# Altium project NANO33BLE_V2.0.PrjPcb
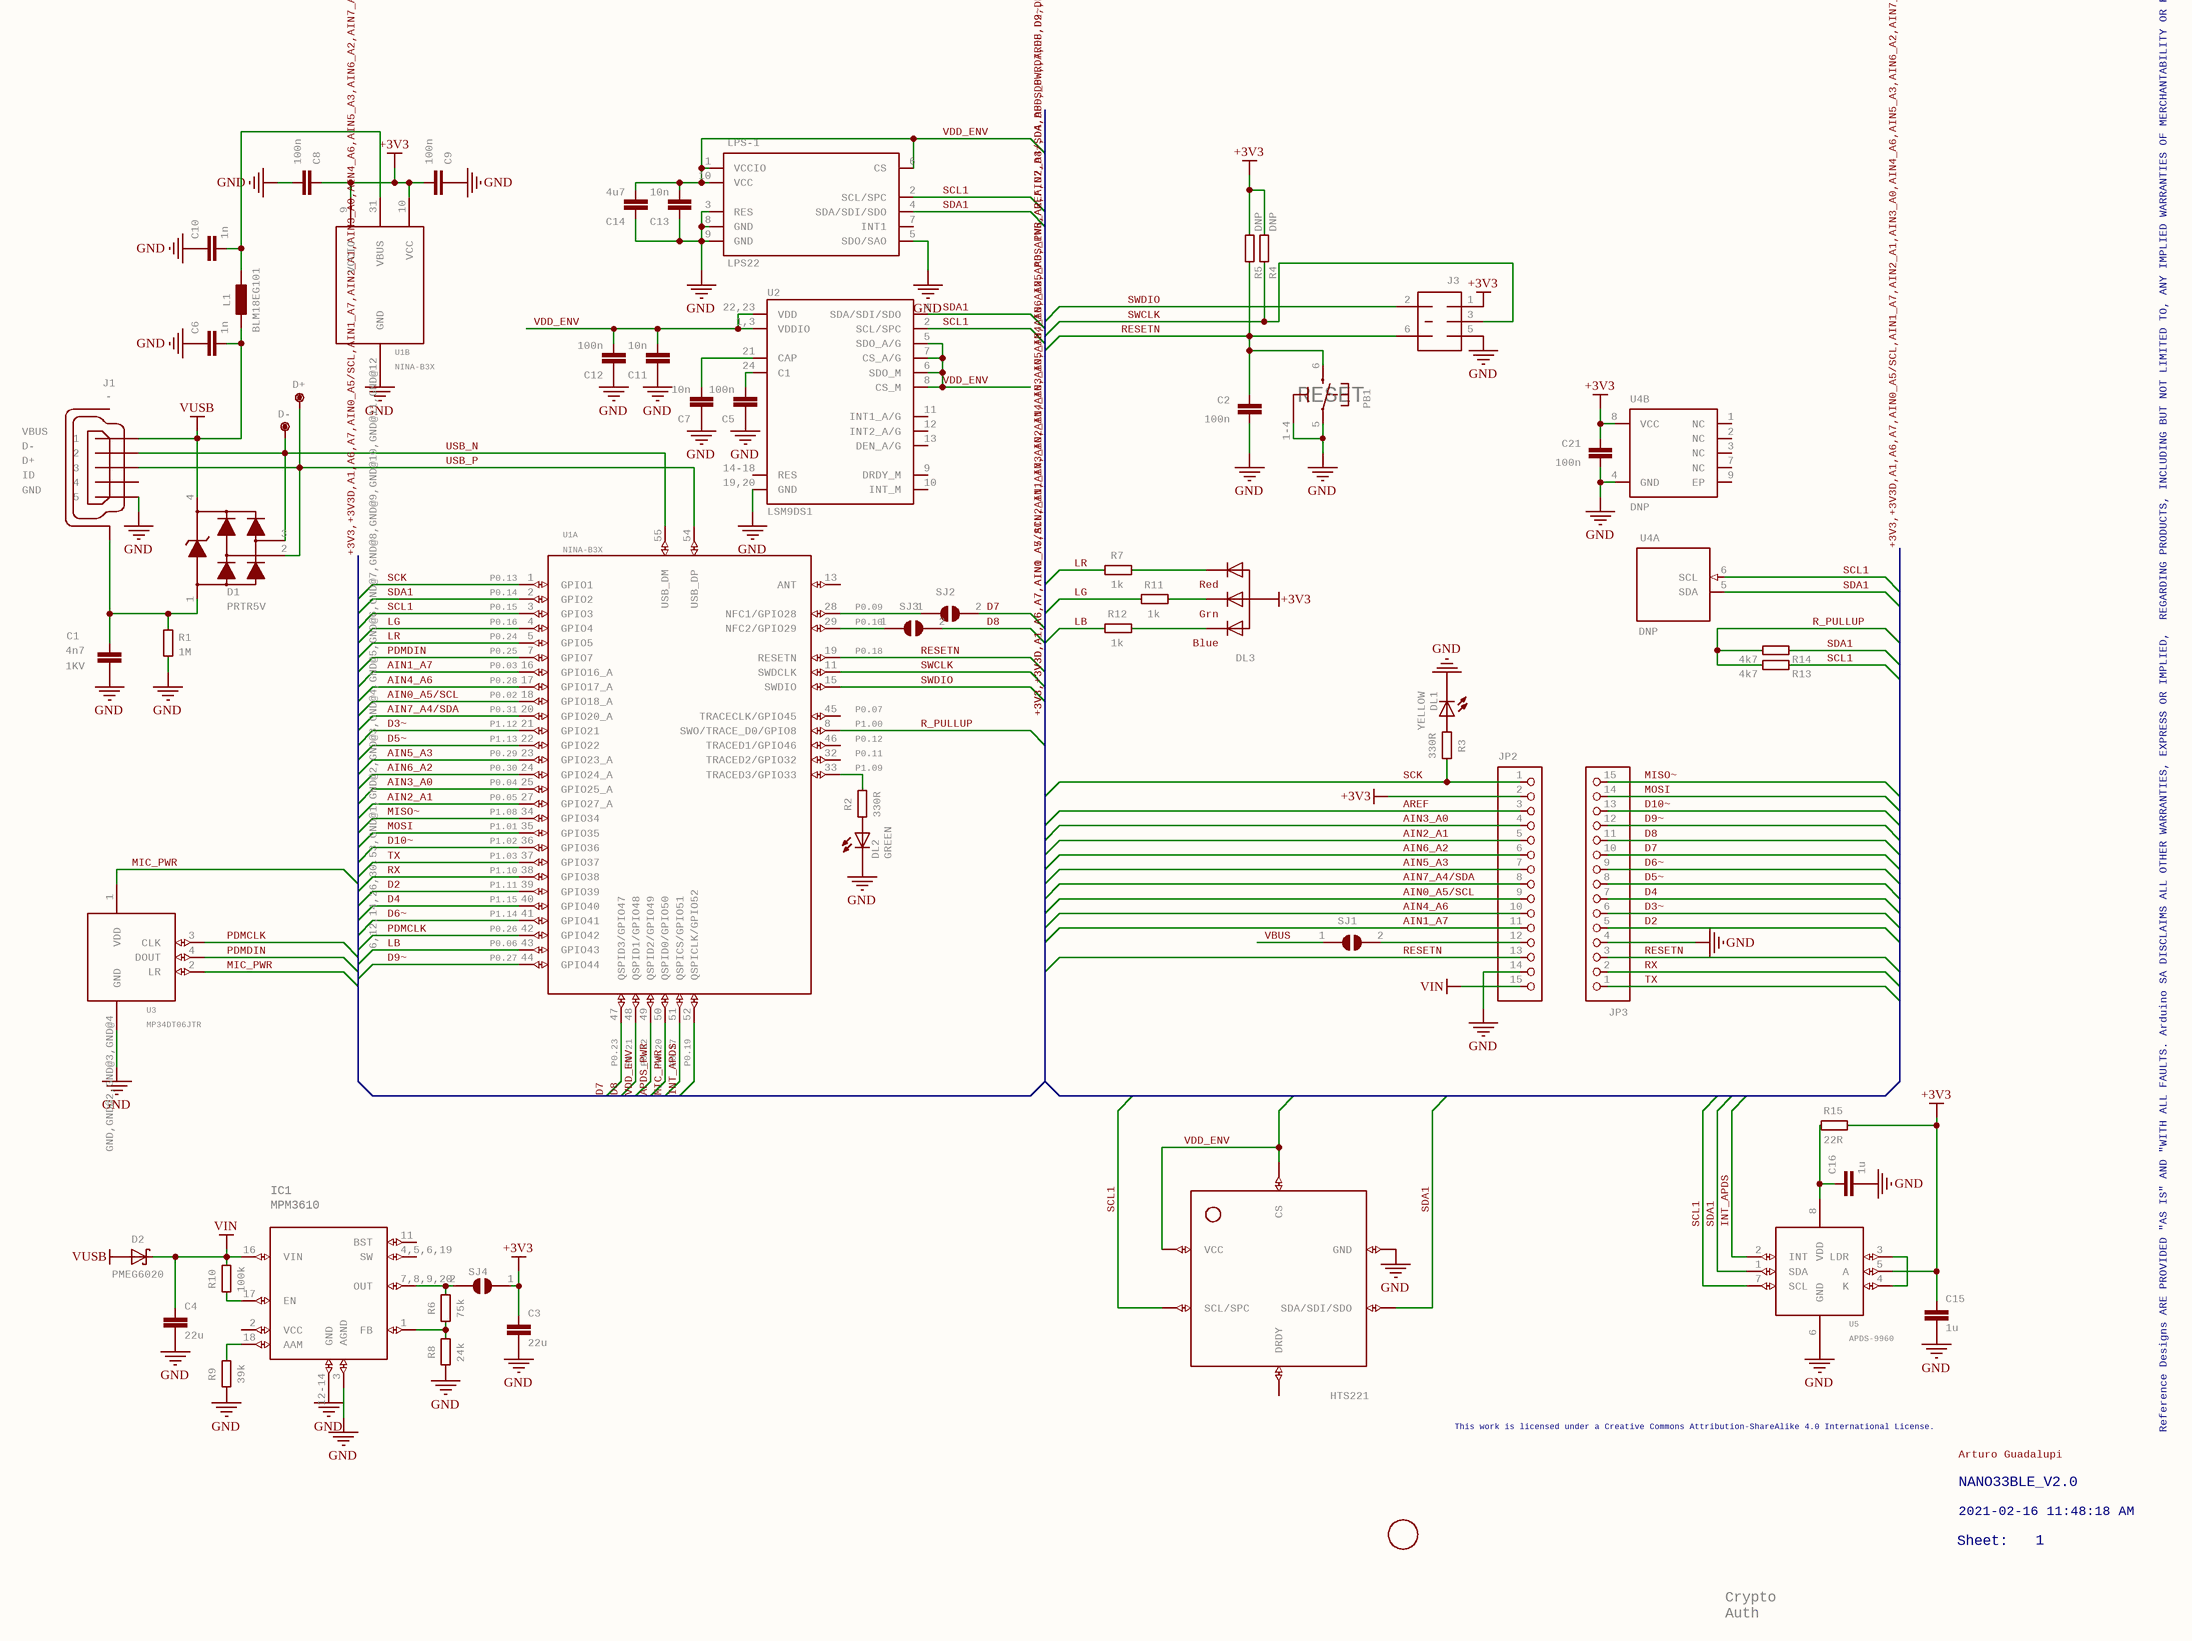
[diagram p0: NANO33BLE_V2.0.SchDoc]
1 sheet, 58 parts. Net scope: global (net labels, ports and power ports of the same name join across sheets).
Board file: NANO33BLE_V2.0.PcbDoc

## Sheet NANO33BLE_V2.0.SchDoc: NANO33BLE_V2.0
size 409 x 289 mm; Origin: Eagle; Date: 2021-02-16 11:48:18 AM; SheetNumber: 1; CODE-ARDUINO: DNP; DATASHEET: DNP; DISTRIBUTOR-LINK: DNP; DISTRIBUTOR-PN: DNP; MANUFACTURER: DNP; MANUFACTURER-PN: DNP; NOTE: DNP; Value: DNP; GateName_1: G$1; SymbolName_1: A3L-LOC; LibraryName: Arduino-utility; DeviceSetName: A3-FRAME; Sheet: Sheet:; ReferenceDesignsAREPROVIDED"ASIS"AND"WITHALLFAULTS.ArduinoSADISCLAIMSALLOTHERWARRANTIES,EXPRESSORIMPLIED,
REGARDINGPRODUCTS,INCLUDINGBUTNOTLIMITEDTO,ANYIMPLIEDWARRANTIESOFMERCHANTABILITYORFITNESSFORAPARTICULARPURPOSE

ArduinoSAmaymakechangestospecificationsandproductdescriptionsatanytime,withoutnotice.TheCustomermustnot
relyontheabsenceorcharacteristicsofanyfeaturesorinstructionsmarked"reserved"or"undefined."ArduinoSAreserves
theseforfuturedefinitionandshallhavenoresponsibilitywhatsoeverforconflictsorincompatibilitiesarisingfromfuturechangestothem.
TheproductinformationontheWebSiteorMaterialsissubjecttochangewithoutnotice.Donotfinalizeadesignwiththisinfo

ARDUINOandotherArduinobrandsandlogosandTrademarksofArduinoSA.AllArduinoSATrademarkscannotbeusedwithoutowner'sformalpermission: Reference Designs ARE PROVIDED "AS IS" AND "WITH ALL FAULTS. Arduino SA DISCLAIMS ALL OTHER WARRANTIES, EXPRESS OR IMPLIED, / REGARDING PRODUCTS, INCLUDING BUT NOT LIMITED TO, ANY IMPLIED WARRANTIES OF MERCHANTABILITY OR FITNESS FOR A PARTICULAR PURPOSE / Arduino SA may make changes to specifications and product descriptions at any time, without notice. The Customer must not / rely on the absence or characteristics of any features or instructions marked "reserved" or "undefined." Arduino SA reserves / these for future definition and shall have no responsibility whatsoever for conflicts or incompatibilities arising from future changes to them. / The product information on the Web Site or Materials is subject to change without notice. Do not finalize a design with this info / ARDUINO and other Arduino brands and logos and Trademarks of Arduino SA. All Arduino SA Trademarks cannot be used without owner's formal permission; ThisworkislicensedunderaCreativeCommonsAttribution-ShareAlike4.0InternationalLicense.: This work is licensed under a Creative Commons Attribution-ShareAlike 4.0 International License.

### Parts
C1  4n7  VOLTAGE: 1KV  [0805-R2013X50N]
C2  100n  [0402-1005X55N]
C3  22u  [0805-R2013X50N]
C4  22u  [0805-R2013X50N]
C5  100n  [0402-1005X55N]
C6  1n  [0402-1005X55N]
C7  10n  [0402-1005X55N]
C8  100n  [0402-1005X55N]
C9  100n  [0402-1005X55N]
C10  1n  [0402-1005X55N]
C11  10n  [0402-1005X55N]
C12  100n  [0402-1005X55N]
C13  10n  [0402-1005X55N]
C14  4u7  [0402-1005X55N]
C15  1u  [0402-1005X55N]
C16  1u  [0402-1005X55N]
C21  100n  [0402-1005X55N]
D1  PRTR5V  [SOT190P230X110-4N]
D2  PMEG6020  [SODFL3517X110N]
D+  DNP  [TP-1.00MM]  (value not drawn)
D-  DNP  [TP-1.00MM]  (value not drawn)
DL1  YELLOW  [LEDC1608X80N-AK]
DL2  GREEN  [LEDC1608X80N-AK]
DL3  -  [SMLP34RGB2W]  (value not drawn)
FD1  DNP  [FD-1-1.5]  (value not drawn)
HS-1  HTS221  [HTS221]  (value not drawn)
IC1  MPM3610  [MPM3610]
J1  -  [ZX62-AB-5PA]
J3  DNP  [2X03-TP1]  (value not drawn)
JP2  PINHD-1X15-CASTELLATED  [1X15-CASTELL]  (value not drawn)
JP3  PINHD-1X15-CASTELLATED  [1X15-CASTELL]  (value not drawn)
L1  BLM18EG101  [0603-1608X90N]
LPS-1  LPS22  [LPS22H]
PB1  PTS820  [C&K_PTS820_NO_HOLES]  (value not drawn)
R1  1M  [0402-1005X55N]
R2  330R  [0402-1005X55N]
R3  330R  [0402-1005X55N]
R4  DNP  [0402-1005X55N]
R5  DNP  [0402-1005X55N]
R6  75k  [0402-1005X55N]
R7  1k  [0402-1005X55N]
R8  24k  [0402-1005X55N]
R9  39k  [0402-1005X55N]
R10  100k  [0402-1005X55N]
R11  1k  [0402-1005X55N]
R12  1k  [0402-1005X55N]
R13  4k7  [0402-1005X55N]
R14  4k7  [0402-1005X55N]
R15  22R  [0402-1005X55N]
SJ1  DNP  [SJ]  (value not drawn)
SJ2  DNP  [SJ]  (value not drawn)
SJ3  DNP  [SJ]  (value not drawn)
SJ4  DNP  [SJ]  (value not drawn)
U1  NINA-B3X  [NINA-B3X]  (parts A,B of 2)
U2  LSM9DS1  [LSM9DS1_TEMP_LGA24-8X4]
U3  MP34DT06JTR  [HCLGA]
U4  DNP  [SON50P300X200X60-9N-EP160X140]  (parts A,B of 2)
U5  APDS-9960  [APDS9960]

### Nets
+3V3: C3.1 C8.1 C9.2 C15.1 C21.1 DL3.1(A) J3.1 JP2.2 R4.2 R5.2 R15.2 SJ4.1 U1.9(VCCIO) U1.10(VCC) U4.8(VCC) U5.5(A)
GND: C1.2 C2.2 C3.2 C4.2 C5.1 C6.1 C7.1 C8.2 C9.1 C10.1 C11.1 C12.1 C13.1 C14.1 C15.2 C16.2 C21.2 DL1.C DL2.C HS-1.P$5.GND(GND) IC1.3(AGND) IC1.12-14(GND) J1.5 J3.5 JP2.14 JP3.4 LPS-1.3(RES) LPS-1.5(SDO/SAO) LPS-1.8(GND) LPS-1.9(GND) PB1.1-4 PB1.5 R1.1 R8.1 R9.1 U1.6,12,14,26,30,53,GND@1,GND@2,GND@3,GND@4,GND@5,GND@6,GND@7,GND@8,GND@9,GND@10,GND@11,GND@12(GND) U2.19,20(GND) U3.GND,GND@2,GND@3,GND@4(GND) U4.4(GND) U5.6(GND)
VIN: C4.1 D2.C IC1.16(VIN) JP2.15 R10.2
VUSB: C6.2 D1.4 D2.A J1.1 L1.1
AIN0_A5/SCL: JP2.9 U1.18(GPIO18_A)
AIN1_A7: JP2.11 U1.16(GPIO16_A)
AIN2_A1: JP2.5 U1.27(GPIO27_A)
AIN3_A0: JP2.4 U1.25(GPIO25_A)
AIN4_A6: JP2.10 U1.17(GPIO17_A)
AIN5_A3: JP2.7 U1.23(GPIO23_A)
AIN6_A2: JP2.6 U1.24(GPIO24_A)
AIN7_A4/SDA: JP2.8 U1.20(GPIO20_A)
APDS_PWR: U1.50(QSPID0/GPIO50)
AREF: JP2.3
D2: JP3.5 U1.39(GPIO39)
D3~: JP3.6 U1.21(GPIO21)
D4: JP3.7 U1.40(GPIO40)
D5~: JP3.8 U1.22(GPIO22)
D6~: JP3.9 U1.41(GPIO41)
D7: JP3.10 SJ2.2 U1.47(QSPID3/GPIO47)
D8: JP3.11 R12.1 SJ3.2 U1.43(GPIO43) U1.48(QSPID1/GPIO48)  [also labelled LB]
D9~: JP3.12 U1.44(GPIO44)
D10~: JP3.13 U1.36(GPIO36)
INT_APDS: U1.52(QSPICLK/GPIO52) U5.2(INT)
LG: R11.1 U1.4(GPIO4)
LR: R7.1 U1.5(GPIO5)
MIC_PWR: U1.51(QSPICS/GPIO51) U3.1(VDD) U3.2(LR)
MISO~: JP3.15 U1.34(GPIO34)
MOSI: JP3.14 U1.35(GPIO35)
PDMCLK: U1.42(GPIO42) U3.3(CLK)
PDMDIN: U1.7(GPIO7) U3.4(DOUT)
R_PULLUP: R13.2 R14.2 U1.8(SWO/TRACE_D0/GPIO8)
RESETN: C2.1 J3.6 JP2.13 JP3.3 PB1.6 R5.1 U1.19(RESETN)
RX: JP3.2 U1.38(GPIO38)
SCK: JP2.1 R3.2 U1.1(GPIO1)
SCL1: HS-1.P$2.SCL/SPC(SCL/SPC) LPS-1.2(SCL/SPC) R13.1 U1.3(GPIO3) U2.2(SCL/SPC) U4.6(SCL) U5.7(SCL)
SDA1: HS-1.P$4.SDA/SDI/SDO(SDA/SDI/SDO) LPS-1.4(SDA/SDI/SDO) R14.1 U1.2(GPIO2) U2.4(SDA/SDI/SDO) U4.5(SDA) U5.1(SDA)
SWCLK: J3.3 R4.1 U1.11(SWDCLK)
SWDIO: J3.2 U1.15(SWDIO)
TX: JP3.1 U1.37(GPIO37)
USB_N: D1.3 D-.X(P$1) J1.2 U1.55(USB_DM)
USB_P: D1.2 D+.X(P$1) J1.3 U1.54(USB_DP)
VBUS: SJ1.1
VDD_ENV: C11.2 C12.2 C13.2 C14.2 HS-1.P$1.VDD(VCC) HS-1.P$6.CS(CS) LPS-1.1(VCCIO) LPS-1.6(CS) LPS-1.10(VCC) U1.49(QSPID2/GPIO49) U2.1,3(VDDIO) U2.5(SDO_A/G) U2.6(SDO_M) U2.7(CS_A/G) U2.8(CS_M) U2.22,23(VDD)
NetC1_1: C1.1 D1.1 J1.6-11(SH) R1.2
NetC5_2: C5.2 U2.24(C1)
NetC7_2: C7.2 U2.21(CAP)
NetC10_2: C10.2 L1.2 U1.31(VBUS)
NetC16_1: C16.1 R15.1 U5.8(VDD)
NetDL1_A: DL1.A R3.1
NetDL2_A: DL2.A R2.1
NetDL3_2: DL3.2(RED_C) R7.2
NetDL3_3: DL3.3(BLUE_C) R12.2
NetDL3_4: DL3.4(GREEN_C) R11.2
NetIC1_1: IC1.1(FB) R6.1 R8.2
NetIC1_7,8,9,20: IC1.7,8,9,20(OUT) R6.2 SJ4.2
NetIC1_17: IC1.17(EN) R10.1
NetIC1_18: IC1.18(AAM) R9.2
NetJP2_12: JP2.12 SJ1.2
NetR2_2: R2.2 U1.33(TRACED3/GPIO33)
NetSJ2_1: SJ2.1 U1.28(NFC1/GPIO28)
NetSJ3_1: SJ3.1 U1.29(NFC2/GPIO29)
NetU5_3: U5.3(LDR) U5.4(K)

Not connected (* = marked no-connect by the designer): HS-1 P$3.DRDY(DRDY); IC1 2(VCC) 4,5,6,19(SW) 11(BST); J1 4; LPS-1 7(INT1); U1 13(ANT) 32(TRACED2/GPIO32) 45(TRACECLK/GPIO45) 46(TRACED1/GPIO46); U2 9(DRDY_M) 10(INT_M) 11(INT1_A/G) 12(INT2_A/G) 13(DEN_A/G) 14-18(RES); U4 1(NC) 2(NC) 3(NC) 7(NC) 9(EP)

### Buses and harness runs
bus +3V3,+3V3D,A1,A6,A7,AIN0_A5/SCL,AIN1_A7,AIN2_A1,AIN3_A0,AIN4_A6,AIN5_A3,AIN6_A2,AIN7_A4/SDA,APDS_PWR,AREF,D2,D3~,D4,D5~,D6~,D7,D8,D9~,D10~,GND,INT_APDS,LB,LED_BLUE,LED_GREEN,LED_RED,LG,LR,MIC_PWR,MISO~,MOSI,NFC1,NFC2,PA12_S2_TX/MOSI,PA13_S2_RX/MISO,PA14_S2_RTS/CS,PA15_S2_CTS/SCK,PA22_TC4-W0,PA23_TC4-W1,PA27_GPIO0,PA28_ACK,PB08_RST,PB11_TCC0-W5,PDMCLK,PDMDIN,RESET#,RESETN,R_PULLUP,RSTN_NINA,RX,RX_NINA,SCK,SCL1,SDA1,SWCLK,SWDIO,TX,TX_NINA,USB_N,USB_P,VBUS,VDD_ENV,VIN,VUSB = +3V3,+3V3D,A1,A6,A7,AIN1_A7,AIN2_A1,AIN3_A0,AIN4_A6,AIN5_A3,AIN6_A2,APDS_PWR,AREF,D2,D3~,D4,D5~,D6~,D7,D8,D9~,D10~,GND,LB,LED_BLUE,LED_GREEN,LED_RED,LG,LR,MISO~,MOSI,N$1,N$2,N$3,N$4,N$5,N$6,N$7,N$8,N$10,N$11,N$12,N$13,NFC1,NFC2,PA12_S2_TX/MOSI,PA13_S2_RX/MISO,PA14_S2_RTS/CS,PA15_S2_CTS/SCK,PA27_GPIO0,PA28_ACK,PB08_RST,RESETN,R_PULLUP,RSTN_NINA,RX,RX_NINA,SCK,SCL1,SDA1,SWCLK,SWDIO,TX,TX_NINA,USB_N,USB_P,VBUS,VDD_ENV,VIN,VUSB

### Notes on the sheet
- RESET
- (near HS-1) HTS221
- This work is licensed under a Creative Commons Attribution-ShareAlike 4.0 International License.
- Reference Designs ARE PROVIDED "AS IS" AND "WITH ALL FAULTS. Arduino SA DISCLAIMS ALL OTHER WARRANTIES, EXPRESS OR IMPLIED,
  REGARDING PRODUCTS, INCLUDING BUT NOT LIMITED TO, ANY IMPLIED WARRANTIES OF MERCHANTABILITY OR FITNESS FOR A PARTICULAR PURPOSE
  Arduino SA may make changes to specifications and product descriptions at any time, without notice. The Customer must not
  rely on the absence or characteristics of any features or instructions marked "reserved" or "undefined." Arduino SA reserves
  these for future definition and shall have no responsibility whatsoever for conflicts or incompatibilities arising from future changes to them.
  The product information on the Web Site or Materials is subject to change without notice. Do not finalize a design with this info
  ARDUINO and other Arduino brands and logos and Trademarks of Arduino SA. All Arduino SA Trademarks cannot be used without owner's formal permission
- Arturo Guadalupi
- NANO33BLE_V2.0
- Sheet:
- 2021-02-16 11:48:18 AM
- 1
- Crypto
  Auth

### Library data of the parts
C1 = C-0805: SMD Capacitor; MANUFACTURER: Kemet; MANUFACTURER-PN: C0805C472KDRACTU; GateName_1: G$1; SymbolName_1: C; DeviceName: -0805; CODE-ARDUINO: 0689; LibraryName: Arduino-rcl; DeviceSetName: C; DATASHEET: http://www.kemet.com/Lists/ProductCatalog/Attachments/40/KEM_C1010_X7R_HV_SMD.pdf; DISTRIBUTOR-LINK: www.kemet.com/docfinder?Partnumber=C0805C472KDRACTU; DISTRIBUTOR-PN: 399-6738-1-ND; NOTE: -
C2 C5 C8 C9 C12 C21 = C-0402: SMD Capacitor; MANUFACTURER: TDK; MANUFACTURER-PN: C1005X5R1H104K050BB; GateName_1: G$1; SymbolName_1: C; DeviceName: -0402; CODE-ARDUINO: 0132; LibraryName: Arduino-rcl; DeviceSetName: C; DATASHEET: http://www.tdk.com/pdf/TDKMLCCCapRange.pdf; DISTRIBUTOR-LINK: http://www.digikey.com/product-detail/en/tdk-corporation/C1005X5R1H104K050BB/445-5942-1-ND/2443982; DISTRIBUTOR-PN: 445-5942-1-ND; NOTE: -
C3 C4 = C-0805: SMD Capacitor; MANUFACTURER: Samsung; MANUFACTURER-PN: CL21A226MQCLQNC; GateName_1: G$1; SymbolName_1: C; DeviceName: -0805; CODE-ARDUINO: 2233; LibraryName: Arduino-rcl; DeviceSetName: C; DATASHEET: https://media.digikey.com/pdf/Data%20Sheets/Samsung%20PDFs/CL21A226MQCLQNC_character.pdf; DISTRIBUTOR-LINK: https://www.digikey.com/product-detail/en/samsung-electro-mechanics-america-inc/CL21A226MQCLQNC/1276-2412-1-ND/3890498; DISTRIBUTOR-PN: 1276-2412-1-ND; NOTE: -
C6 C10 = C-0402: SMD Capacitor; MANUFACTURER: Samsung; MANUFACTURER-PN: CL05B102KB5NNNC; GateName_1: G$1; SymbolName_1: C; DeviceName: -0402; CODE-ARDUINO: 2321; LibraryName: Arduino-rcl; DeviceSetName: C; DATASHEET: http://www.samsungsem.com/kr/support/product-search/mlcc/__icsFiles/afieldfile/2016/08/18/S_CL05B102KB5NNNC.pdf; DISTRIBUTOR-LINK: http://www.digikey.com/product-detail/en/samsung-electro-mechanics-america-inc/CL05B102KB5NNNC/1276-1032-1-ND/3889118; DISTRIBUTOR-PN: 1276-1032-1-ND; NOTE: -
C7 C11 C13 = C-0402: SMD Capacitor; MANUFACTURER: Murata; MANUFACTURER-PN: GRM155R71H103KA88J; GateName_1: G$1; SymbolName_1: C; DeviceName: -0402; CODE-ARDUINO: 0165; LibraryName: Arduino-rcl; DeviceSetName: C; DATASHEET: http://search.murata.co.jp/Ceramy/image/img/A01X/partnumbering_e_01.pdf; DISTRIBUTOR-LINK: http://www.digikey.com/product-detail/en/murata-electronics-north-america/GRM155R71H103KA88J/490-6351-1-ND/3845548; DISTRIBUTOR-PN: 490-6351-1-ND; NOTE: -
C14 = C-0402: SMD Capacitor; MANUFACTURER: Murata; MANUFACTURER-PN: GRM155R60J475ME47D; GateName_1: G$1; SymbolName_1: C; DeviceName: -0402; CODE-ARDUINO: 0833; LibraryName: Arduino-rcl; DeviceSetName: C; DATASHEET: http://search.murata.co.jp/Ceramy/image/img/A01X/partnumbering_e_01.pdf; DISTRIBUTOR-LINK: http://www.digikey.com/product-detail/en/murata-electronics-north-america/GRM155R60J475ME47D/490-5915-1-ND/3719860; DISTRIBUTOR-PN: 490-5915-1-ND; NOTE: -
C15 C16 = C-0402: SMD Capacitor; MANUFACTURER: Murata; MANUFACTURER-PN: GRM155R61E105KA12D; GateName_1: G$1; SymbolName_1: C; DeviceName: -0402; CODE-ARDUINO: 0133; LibraryName: Arduino-rcl; DeviceSetName: C; DATASHEET: http://search.murata.co.jp/Ceramy/image/img/A01X/partnumbering_e_01.pdf; DISTRIBUTOR-LINK: http://www.digikey.com/product-detail/en/murata-electronics-north-america/GRM155R61E105KA12D/490-10017-1-ND/5026367; DISTRIBUTOR-PN: 490-10017-1-ND; NOTE: -
D1 = PRTR5V0U2X,215: USB ESD protection; MANUFACTURER: NXP; GateName_1: G$1; CODE-ARDUINO: 2209; SymbolName_1: PRTR5V0U2X; LibraryName: Arduino-diodes; DeviceSetName: PRTR5V0U2X,215; DATASHEET: http://www.nxp.com/documents/data_sheet/PRTR5V0U2X.pdf; DISTRIBUTOR-LINK: http://www.digikey.com/product-detail/en/nxp-semiconductors/PRTR5V0U2X,215/568-4140-1-ND/1589981; DISTRIBUTOR-PN: 568-4140-1-ND; MANUFACTURER-PN: PRTR5V0U2X,215
D2 = PMEG6020AELRX: 60 V, 2 A low leakage current Schottky barrier rectifier   Datasheet; MANUFACTURER: NXP; GateName_1: G$1; SymbolName_1: SCHOTTKY-2; CODE-ARDUINO: 2208 or 0025; LibraryName: Arduino-diodes; DeviceSetName: PMEG6020AELRX; DATASHEET: http://www.nxp.com/documents/data_sheet/PMEG6020AELR.pdf; DISTRIBUTOR-LINK: http://www.digikey.com/products/en?keywords=%20568-12710-1-ND; DISTRIBUTOR-PN: 568-12710-1-ND; MANUFACTURER-PN: PMEG6020AELRX
D+ D- = TPTP-1.00MM: Testpoint; GateName_1: G$1; DeviceSetName: TP; SymbolName_1: TESTPOINT; DeviceName: TP-1.00MM; LibraryName: Arduino-utility; CODE-ARDUINO: DNP; DATASHEET: DNP; DISTRIBUTOR-LINK: DNP; DISTRIBUTOR-PN: DNP; MANUFACTURER: DNP; MANUFACTURER-PN: DNP
DL1 = LED-0603: LED; MANUFACTURER: Avago; MANUFACTURER-PN: HSMY-C190; GateName_1: G$1; DeviceName: -0603; CODE-ARDUINO: 2243; SymbolName_1: LED; LibraryName: Arduino-diodes; DeviceSetName: LED; DATASHEET: http://media.digikey.com/pdf/Data%20Sheets/Avago%20PDFs/HSMz-Czzz.pdf; DISTRIBUTOR-LINK: http://www.digikey.com/product-detail/en/broadcom-limited/HSMY-C190/516-1424-1-ND/637748; DISTRIBUTOR-PN: 516-1424-1-ND
DL2 = LED-0603: LED; MANUFACTURER: Avago; MANUFACTURER-PN: HSMG-C190; GateName_1: G$1; DeviceName: -0603; CODE-ARDUINO: 2204; SymbolName_1: LED; LibraryName: Arduino-diodes; DeviceSetName: LED; DATASHEET: http://media.digikey.com/pdf/Data%20Sheets/Avago%20PDFs/HSMz-Czzz.pdf; DISTRIBUTOR-LINK: http://www.digikey.com/product-detail/en/broadcom-limited/HSMG-C190/516-1425-1-ND/637749; DISTRIBUTOR-PN: 516-1425-1-ND
DL3 = RGBLED-KA: 5050 RGB LED; MANUFACTURER-PN: SMLP34RGB2W3; GateName_1: G$1; SymbolName_1: RGBLED-KA; LibraryName: Arduino-diodes; DeviceSetName: RGBLED-KA; Red: Red; Grn: Grn; Blue: Blue; CODE-ARDUINO: CODE-ARDUINO; DATASHEET: https://www.rohm.com/datasheet/SMLP34RGB2W; DISTRIBUTOR-LINK: https://www.digikey.com/product-detail/en/rohm-semiconductor/SMLP34RGB2W3/SMLP34RGB2W3CT-ND/2921110; DISTRIBUTOR-PN: SMLP34RGB2W3CT-ND
FD1 = FIDUCIAL-1.5MM: Fiducial mount; GateName_1: G$1; SymbolName_1: ARDUINO_FIDUCIAL; DeviceName: -1.5MM; LibraryName: Arduino-utility; DeviceSetName: FIDUCIAL; CODE-ARDUINO: DNP; DATASHEET: DNP; DISTRIBUTOR-LINK: DNP; DISTRIBUTOR-PN: DNP; MANUFACTURER: DNP; MANUFACTURER-PN: DNP
HS-1 = HTS221: MANUFACTURER: STMicroelectronics; MANUFACTURER-PN: HTS221TR; GateName_1: G$1; CODE-ARDUINO: A5356; SymbolName_1: HTS221; LibraryName: Arduino-Sensors; DeviceSetName: HTS221; DATASHEET: https://nl.mouser.com/datasheet/2/389/hts221-954783.pdf; DISTRIBUTOR-LINK: https://nl.mouser.com/ProductDetail/STMicroelectronics/HTS221TR?qs=%2fha2pyFaduhYqhgVSCoMJjbIcKdCD1D5p03chi4OA3k%3d; DISTRIBUTOR-PN: 511-HTS221TR
IC1 = MPM3610: MPM3610 Step Down Regulator; MANUFACTURER: MPS; MANUFACTURER-PN: MPM3610AGQV-P; GateName_1: G$1; CODE-ARDUINO: 2093; RESTRICTIONS: NO; SymbolName_1: MPM3610; LibraryName: Arduino-ICs; DeviceSetName: MPM3610; DATASHEET: https://www.monolithicpower.com/pub/media/document/MPM3610_r1.01.pdf; DISTRIBUTOR-LINK: https://www.digikey.com/product-detail/en/monolithic-power-systems-inc/MPM3610AGQV-P/1589-1249-1-ND/5298336; DISTRIBUTOR-PN: 1589-1249-1-ND
J1 = USB-MICRO: USB - micro AB USB 2.0 Receptacle Connector 5 Position Surface Mount, Right Angle, Horizontal; MANUFACTURER: Hirose; MANUFACTURER-PN: ZX62-AB-5PA(31); GateName_1: G$1; CODE-ARDUINO: 2219; SymbolName_1: USB-MICRO; LibraryName: Arduino-connectors; DeviceSetName: USB-MICRO; VBUS: VBUS; D-: D-; D+: D+; ID: ID; GND: GND; DATASHEET: https://www.hirose.com/product/en/download_file/key_name/ZX/category/Catalog/doc_file_id/31704/?file_category_id=4&item_id=13&is_series=1; DISTRIBUTOR-LINK: http://www.digikey.com/product-detail/en/hirose-electric-co-ltd/ZX62-AB-5PA(31)/H125279CT-ND/5994741; DISTRIBUTOR-PN: H125279CT-ND
J3 = PINHD-2X03(NO4): PIN HEADER; GateName_1: G$1; SymbolName_1: 3X02(NO4); LibraryName: Arduino-connectors; DeviceSetName: PINHD-2X03(NO4); CODE-ARDUINO: DNP; DATASHEET: DNP; DISTRIBUTOR-LINK: DNP; DISTRIBUTOR-PN: DNP; MANUFACTURER: DNP; MANUFACTURER-PN: DNP
JP2 JP3 = PINHD-1X15-CASTELLATED: PIN HEADER; GateName_1: A; SymbolName_1: PINHD15; DeviceName: -CASTELLATED; LibraryName: Arduino-connectors; DeviceSetName: PINHD-1X15
L1 = FERRITE0603: SMD ferrite; MANUFACTURER: Murata; MANUFACTURER-PN: BLM18EG101TN1D; GateName_1: >NAME; DeviceName: 0603; SymbolName_1: FERRITE; LibraryName: Arduino-rcl; DeviceSetName: FERRITE; CODE-ARDUINO: -; DATASHEET: http://www.murata.com/en-us/products/productdata/8796747366430/ENFA0021.pdf; DISTRIBUTOR-LINK: https://www.digikey.com/product-detail/en/murata-electronics-north-america/BLM18EG101TN1D/490-5978-1-ND/3845178; DISTRIBUTOR-PN: 490-5978-1-ND; NOTE: -
LPS-1 = LPS2XH-22: MANUFACTURER: ST; MANUFACTURER-PN: LPS22HBTR; GateName_1: G$1; SymbolName_1: LPS25H; DeviceName: -22; DeviceSetName: LPS2XH; CODE-ARDUINO: A5390; LibraryName: Arduino-Sensors; DATASHEET: https://www.st.com/content/ccc/resource/technical/document/datasheet/bf/c1/4f/23/61/17/44/8a/DM00140895.pdf/files/DM00140895.pdf/jcr:content/translations/en.DM00140895.pdf; DISTRIBUTOR-LINK: https://www.digikey.com/product-detail/en/stmicroelectronics/LPS22HBTR/497-16265-1-ND/5799917; DISTRIBUTOR-PN: 497-16265-1-ND
PB1 = TACTILE1PTS820-NH: Tactile Switch SPST-NO Top Actuated Surface Mount; MANUFACTURER: C&K; MANUFACTURER-PN: PTS820 J25K SMTR LFS; GateName_1: G$1; SymbolName_1: TACTILE-3PINS; CODE-ARDUINO: 0173; DeviceName: PTS820-NH; LibraryName: Arduino-pushbuttons; DeviceSetName: TACTILE1; DATASHEET: http://www.ckswitches.com/media/1474/pts820.pdf; DISTRIBUTOR-LINK: https://www.digikey.com/product-detail/en/c-k/PTS820-J15M-SMTR-LFS/CKN10506CT-ND/4176681; DISTRIBUTOR-PN: PTS820 J25K SMTR LFS-ND
R1 = R-0402: SMD Resistor; MANUFACTURER: Yageo; MANUFACTURER-PN: RC0402JR-07330RL; GateName_1: G$1; SymbolName_1: R; DeviceName: -0402; CODE-ARDUINO: 0139; NOTE: NO; LibraryName: Arduino-rcl; DeviceSetName: R; DATASHEET: www.yageo.com.tw/exep/pages/download/literatures/PYu-R_INT-thick_7.pdf; DISTRIBUTOR-LINK: http://www.digikey.com/product-detail/en/yageo/RC0402JR-07330RL/311-330JRCT-ND/729412; DISTRIBUTOR-PN: 311-330JRCT-ND
R2 R3 = R-0402: SMD Resistor; MANUFACTURER: Yageo; MANUFACTURER-PN: RC0402FR-07330RL; GateName_1: G$1; SymbolName_1: R; DeviceName: -0402; CODE-ARDUINO: 2229; NOTE: NO; LibraryName: Arduino-rcl; DeviceSetName: R; DATASHEET: www.yageo.com.tw/exep/pages/download/literatures/PYu-R_INT-thick_7.pdf; DISTRIBUTOR-LINK: http://www.digikey.com/product-detail/en/yageo/RC0402FR-07330RL/311-330LRCT-ND/729541; DISTRIBUTOR-PN: 311-330LRCT-ND
R4 R5 = R-0402: SMD Resistor; GateName_1: G$1; SymbolName_1: R; DeviceName: -0402; NOTE: NO; LibraryName: Arduino-rcl; DeviceSetName: R; CODE-ARDUINO: DNP; DATASHEET: DNP; DISTRIBUTOR-LINK: DNP; DISTRIBUTOR-PN: DNP; MANUFACTURER: DNP; MANUFACTURER-PN: DNP
R6 = R-0402: SMD Resistor; MANUFACTURER: Yageo; MANUFACTURER-PN: AC0402JR-0775KL; GateName_1: G$1; SymbolName_1: R; DeviceName: -0402; CODE-ARDUINO: A5480; NOTE: NO; LibraryName: Arduino-rcl; DeviceSetName: R; DATASHEET: www.yageo.com.tw/exep/pages/download/literatures/PYu-R_INT-thick_7.pdf; DISTRIBUTOR-LINK: https://www.digikey.com/products/en?keywords=%20AC0402JR-0775KL; DISTRIBUTOR-PN: AC0402JR-0775KL-ND
R7 R11 R12 = R-0402: SMD Resistor; MANUFACTURER: Yageo; MANUFACTURER-PN: RC0402FR-071KL; GateName_1: G$1; SymbolName_1: R; DeviceName: -0402; CODE-ARDUINO: 0140; NOTE: NO; LibraryName: Arduino-rcl; DeviceSetName: R; DATASHEET: www.yageo.com.tw/exep/pages/download/literatures/PYu-R_INT-thick_7.pdf; DISTRIBUTOR-LINK: http://www.digikey.com/product-detail/en/yageo/RC0402FR-071KL/311-1.00KLRCT-ND/729460; DISTRIBUTOR-PN: 311-1.00KLRCT-ND
R8 = R-0402: SMD Resistor; MANUFACTURER: Yageo; MANUFACTURER-PN: AC0402JR-0724KL; GateName_1: G$1; SymbolName_1: R; DeviceName: -0402; CODE-ARDUINO: A5478; NOTE: NO; LibraryName: Arduino-rcl; DeviceSetName: R; DATASHEET: http://www.yageo.com/NewPortal/yageodocoutput?fileName=/pdf/R-Chip/PYu-AC_51_RoHS_L_6.pdf; DISTRIBUTOR-LINK: https://www.digikey.com/products/en?keywords=AC0402JR-0724KL; DISTRIBUTOR-PN: AC0402JR-0724KL-ND
R9 = R-0402: SMD Resistor; MANUFACTURER: Yageo; MANUFACTURER-PN: RC0402JR-0739KL; GateName_1: G$1; SymbolName_1: R; DeviceName: -0402; CODE-ARDUINO: A5479; NOTE: NO; LibraryName: Arduino-rcl; DeviceSetName: R; DATASHEET: www.yageo.com.tw/exep/pages/download/literatures/PYu-R_INT-thick_7.pdf; DISTRIBUTOR-LINK: https://www.digikey.com/product-detail/en/yageo/RC0402JR-0739KL/311-39KJRCT-ND/729420; DISTRIBUTOR-PN: 311-39KJRCT-ND
R10 = R-0402: SMD Resistor; MANUFACTURER: Yageo; MANUFACTURER-PN: RC0402FR-07100KL; GateName_1: G$1; SymbolName_1: R; DeviceName: -0402; CODE-ARDUINO: 0134; NOTE: NO; LibraryName: Arduino-rcl; DeviceSetName: R; DATASHEET: www.yageo.com.tw/exep/pages/download/literatures/PYu-R_INT-thick_7.pdf; DISTRIBUTOR-LINK: http://www.digikey.com/product-detail/en/yageo/RC0402FR-07100KL/311-100KLRCT-ND/729473; DISTRIBUTOR-PN: 311-100KLRCT-ND
R13 R14 = R-0402: SMD Resistor; MANUFACTURER: Yageo; MANUFACTURER-PN: RC0402FR-074K7L; GateName_1: G$1; SymbolName_1: R; DeviceName: -0402; CODE-ARDUINO: 2196; NOTE: NO; LibraryName: Arduino-rcl; DeviceSetName: R; DATASHEET: www.yageo.com.tw/exep/pages/download/literatures/PYu-R_INT-thick_7.pdf; DISTRIBUTOR-LINK: http://www.digikey.com/product-detail/en/yageo/RC0402FR-074K7L/311-4.7KLRCT-ND/2827881; DISTRIBUTOR-PN: 311-4.7KLRCT-ND
R15 = R-0402: SMD Resistor; MANUFACTURER: Yageo; MANUFACTURER-PN: RC0402FR-0722RL; GateName_1: G$1; SymbolName_1: R; DeviceName: -0402; CODE-ARDUINO: 0468; NOTE: NO; LibraryName: Arduino-rcl; DeviceSetName: R; DATASHEET: www.yageo.com.tw/exep/pages/download/literatures/PYu-R_INT-thick_7.pdf; DISTRIBUTOR-LINK: http://www.digikey.com/products/en?keywords=311-22.0LRCT-ND; DISTRIBUTOR-PN: 311-22.0LRCT-ND
SJ1-SJ4 = SJ: SMD solder JUMPER; GateName_1: 1; SymbolName_1: SJ; LibraryName: Arduino-utility; DeviceSetName: SJ; CODE-ARDUINO: DNP; DATASHEET: DNP; DISTRIBUTOR-LINK: DNP; DISTRIBUTOR-PN: DNP; MANUFACTURER: DNP; MANUFACTURER-PN: DNP
U1 = NINA-B3X: UBLOX BLE module; GateName_1: A; GateName_2: B; SymbolName_2: NINA-B3X-PS; SymbolName_1: NINA-B3X; LibraryName: Arduino-ucs&SoCs; DeviceSetName: NINA-B3X; P0.13: P0.13; P0.14: P0.14; P0.15: P0.15; P0.16: P0.16; P0.24: P0.24; P0.25: P0.25; P1.00: P1.00; P0.03: P0.03; P0.28: P0.28; P0.02: P0.02; P0.18: P0.18; P0.31: P0.31; P1.12: P1.12; P1.13: P1.13; P0.29: P0.29; P0.30: P0.30; P0.04: P0.04; P0.05: P0.05; P1.08: P1.08; P1.01: P1.01; P1.02: P1.02; P1.03: P1.03; P1.10: P1.10; P1.11: P1.11; P1.15: P1.15; P1.14: P1.14; P0.26: P0.26; P0.06: P0.06; P0.27: P0.27; P0.07: P0.07; P0.12: P0.12; P0.23: P0.23; P0.21: P0.21; P0.22: P0.22; P0.20: P0.20; P0.17: P0.17; P0.19: P0.19; P0.11: P0.11; P1.09: P1.09; P0.09: P0.09; P0.10: P0.10
U2 = LSM9DS1_TEMP_LSM9DS1: LSM9DS1 3D accelerometer, gyroscope & magnetometer    The LSM9DS1 is a system-in-package featuring a 3D digital linear acceleration sensor, a 3D digital angular rate sensor, and a 3D digital magnetic sensor.   The LSM9DS1 has a linear acceleration full scale of Â±2g/Â±4g/Â±8/Â±16 g, a magnetic field full scale of Â±4/Â±8/Â±12/Â±16 gauss and an angular rate of Â±245/Â±500/Â±2000 dps.   The LSM9DS1 includes an I2 C serial bus interface supporting standard and fast mode (100 kHz and 400 kHz) and an SPI serial standard interface.   Magnetic, accelerometer and gyroscope sensing can be enabled or set in power-down mode separately for smart power management.   The LSM9DS1 is available in a plastic land grid array package (LGA) and it is guaranteed to operate over an extended temperature range from -40 Â°C to +85 Â°C.; MANUFACTURER: ST; MANUFACTURER-PN: LSM9DS1TR; GateName_1: G$1; CODE-ARDUINO: A5430; NOTE: NO; SymbolName_1: LSM9DS1_TEMP_LSM9DS1; LibraryName: Arduino-ICs; DeviceSetName: LSM9DS1_TEMP_LSM9DS1; DATASHEET: https://www.st.com/content/ccc/resource/technical/document/datasheet/1e/3f/2a/d6/25/eb/48/46/DM00103319.pdf/files/DM00103319.pdf/jcr:content/translations/en.DM00103319.pdf; DISTRIBUTOR-LINK: https://www.digikey.com/product-detail/en/stmicroelectronics/LSM9DS1TR/497-14946-1-ND/4988079; DISTRIBUTOR-PN: 497-14946-1-ND
U3 = MP34DT06: GateName_1: G$1; CODE-ARDUINO: A5470; SymbolName_1: MP34DT06J; LibraryName: Arduino-Sensors; DeviceSetName: MP34DT06; DATSHEET: https://www.st.com/resource/en/datasheet/mp34dt06j.pdf; DISTRIBUTOR-LINK: https://www.digikey.com/product-detail/en/stmicroelectronics/MP34DT06JTR/497-18180-1-ND/9605997; DISTRIBUTOR-PN: 497-18180-1-ND; MANUFACTURER-PN: MP34DT06JTR
U4 = ATECC8-UDFN: Secure authentication and product validation device, EEPROM, I2C, 2.0 - 5.5V; GateName_1: A; SymbolName_1: ATECC508A-A; GateName_2: B; SymbolName_2: ATECC508A-B; DeviceName: 8-UDFN; DeviceSetName: ATECC; LibraryName: Arduino-ICs; CODE-ARDUINO: DNP; DATASHEET: DNP; DISTRIBUTOR-LINK: DNP; DISTRIBUTOR-PN: DNP; MANUFACTURER: DNP; MANUFACTURER-PN: DNP; NOTE: DNP
U5 = APDS9960: MANUFACTURER: Broadcom; GateName_1: G$1; CODE-ARDUINO: A5475; NOTE: NO; SymbolName_1: APDS9960; LibraryName: Arduino-Sensors; DeviceSetName: APDS9960; DATASHEET: https://docs.broadcom.com/docs/AV02-4191EN; DISTRIBUTOR-LINK: https://www.digikey.com/product-detail/en/broadcom-limited/APDS-9960/516-3480-1-ND/6677150; DISTRIBUTOR-PN: 516-3480-1-ND; MANUFACTURER-PN: APDS-9960